# EAGLE schematic module (EAGLE 7.6.0)
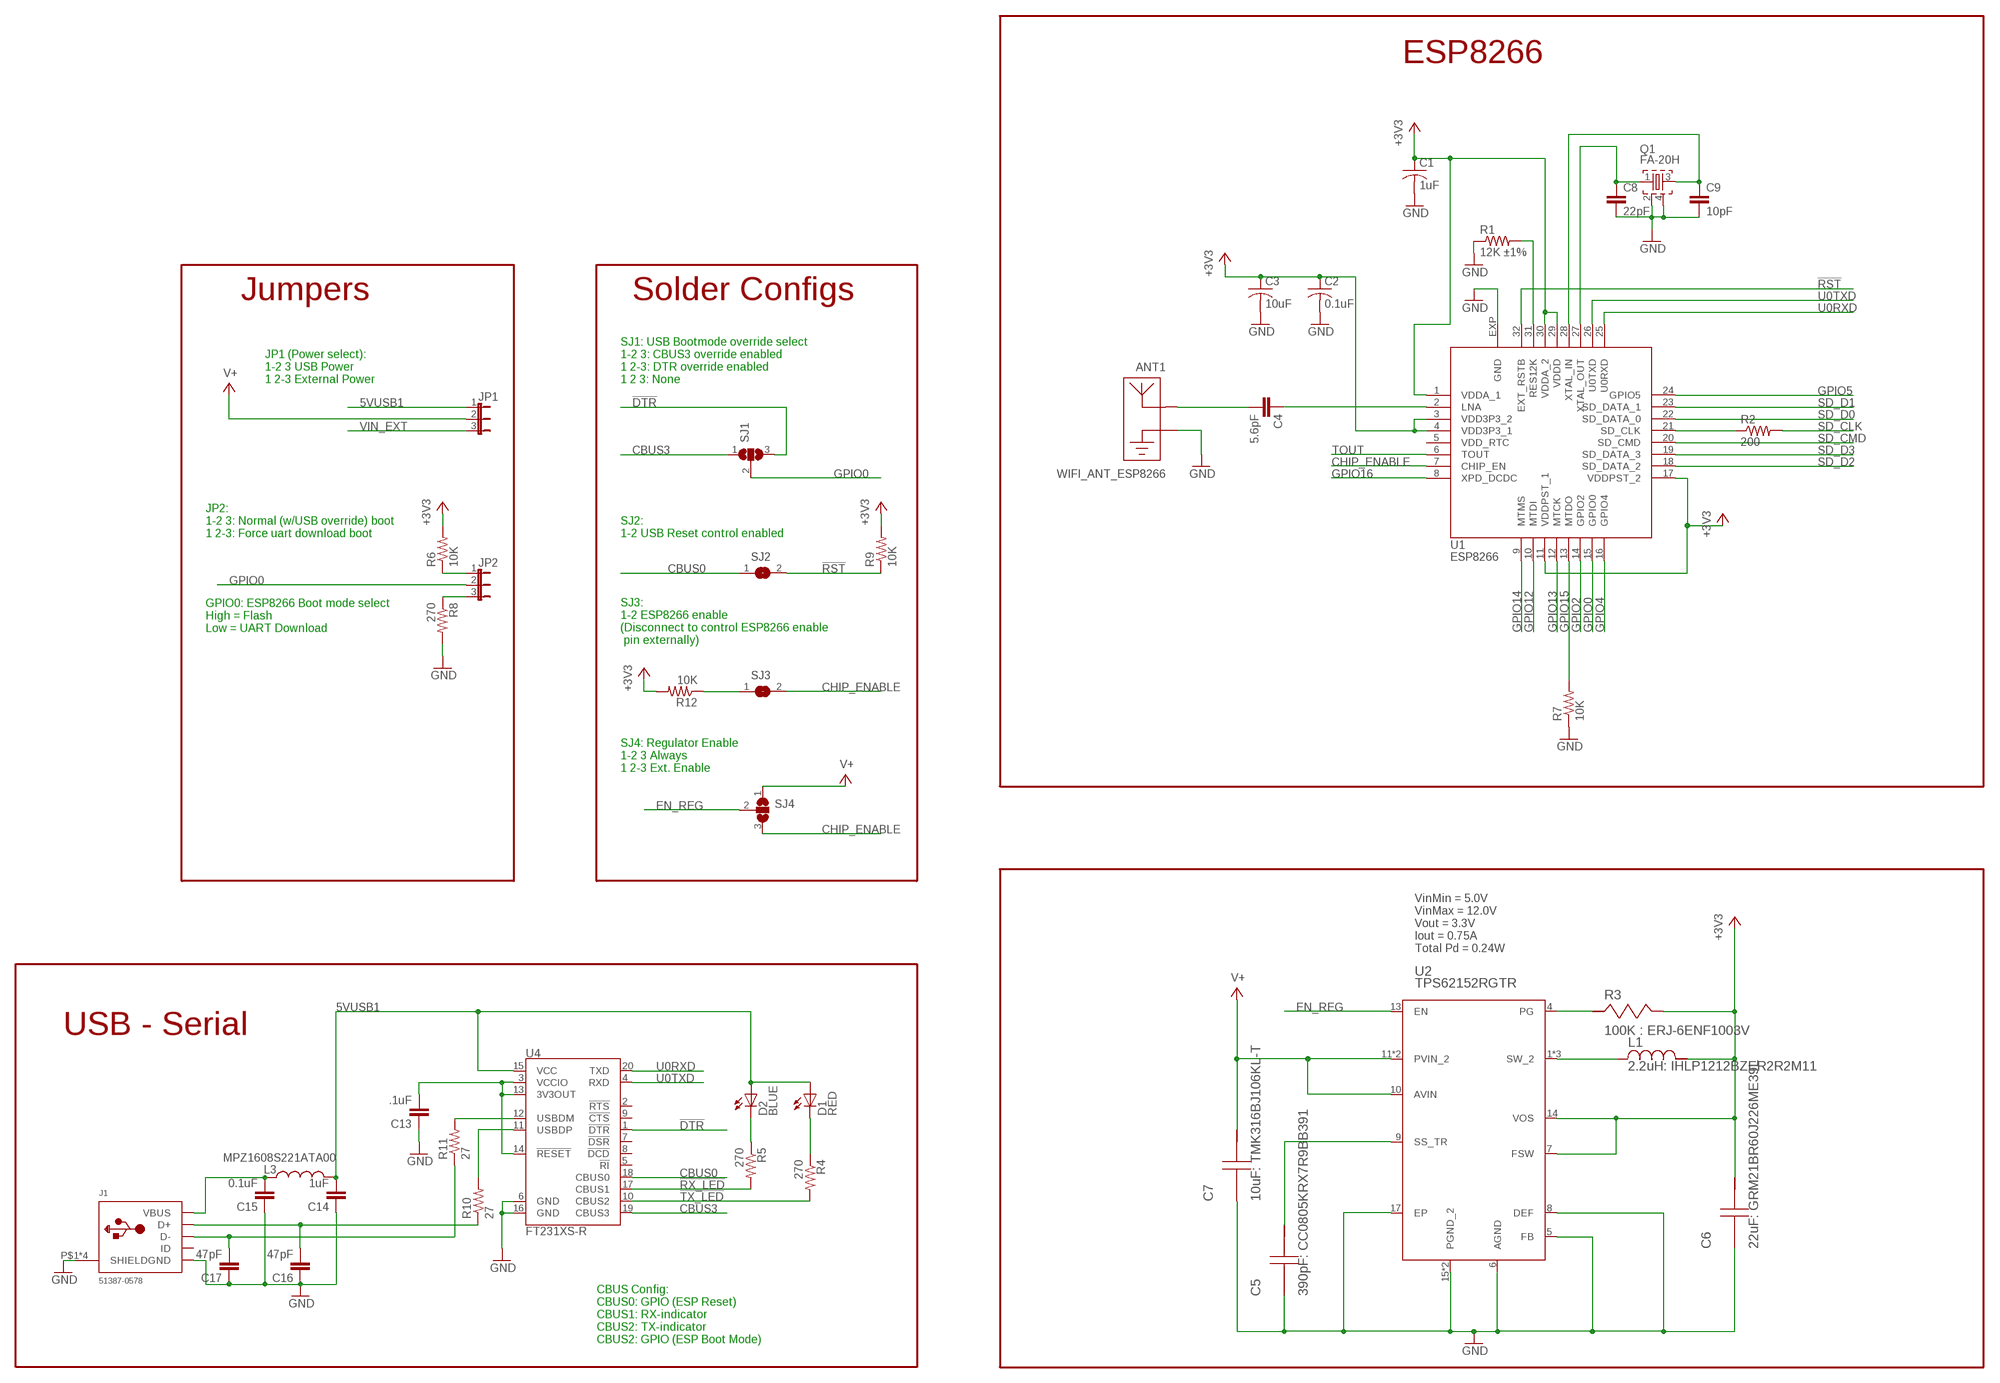
[diagram p0: schematic, sheet 1, part 1 of 2]
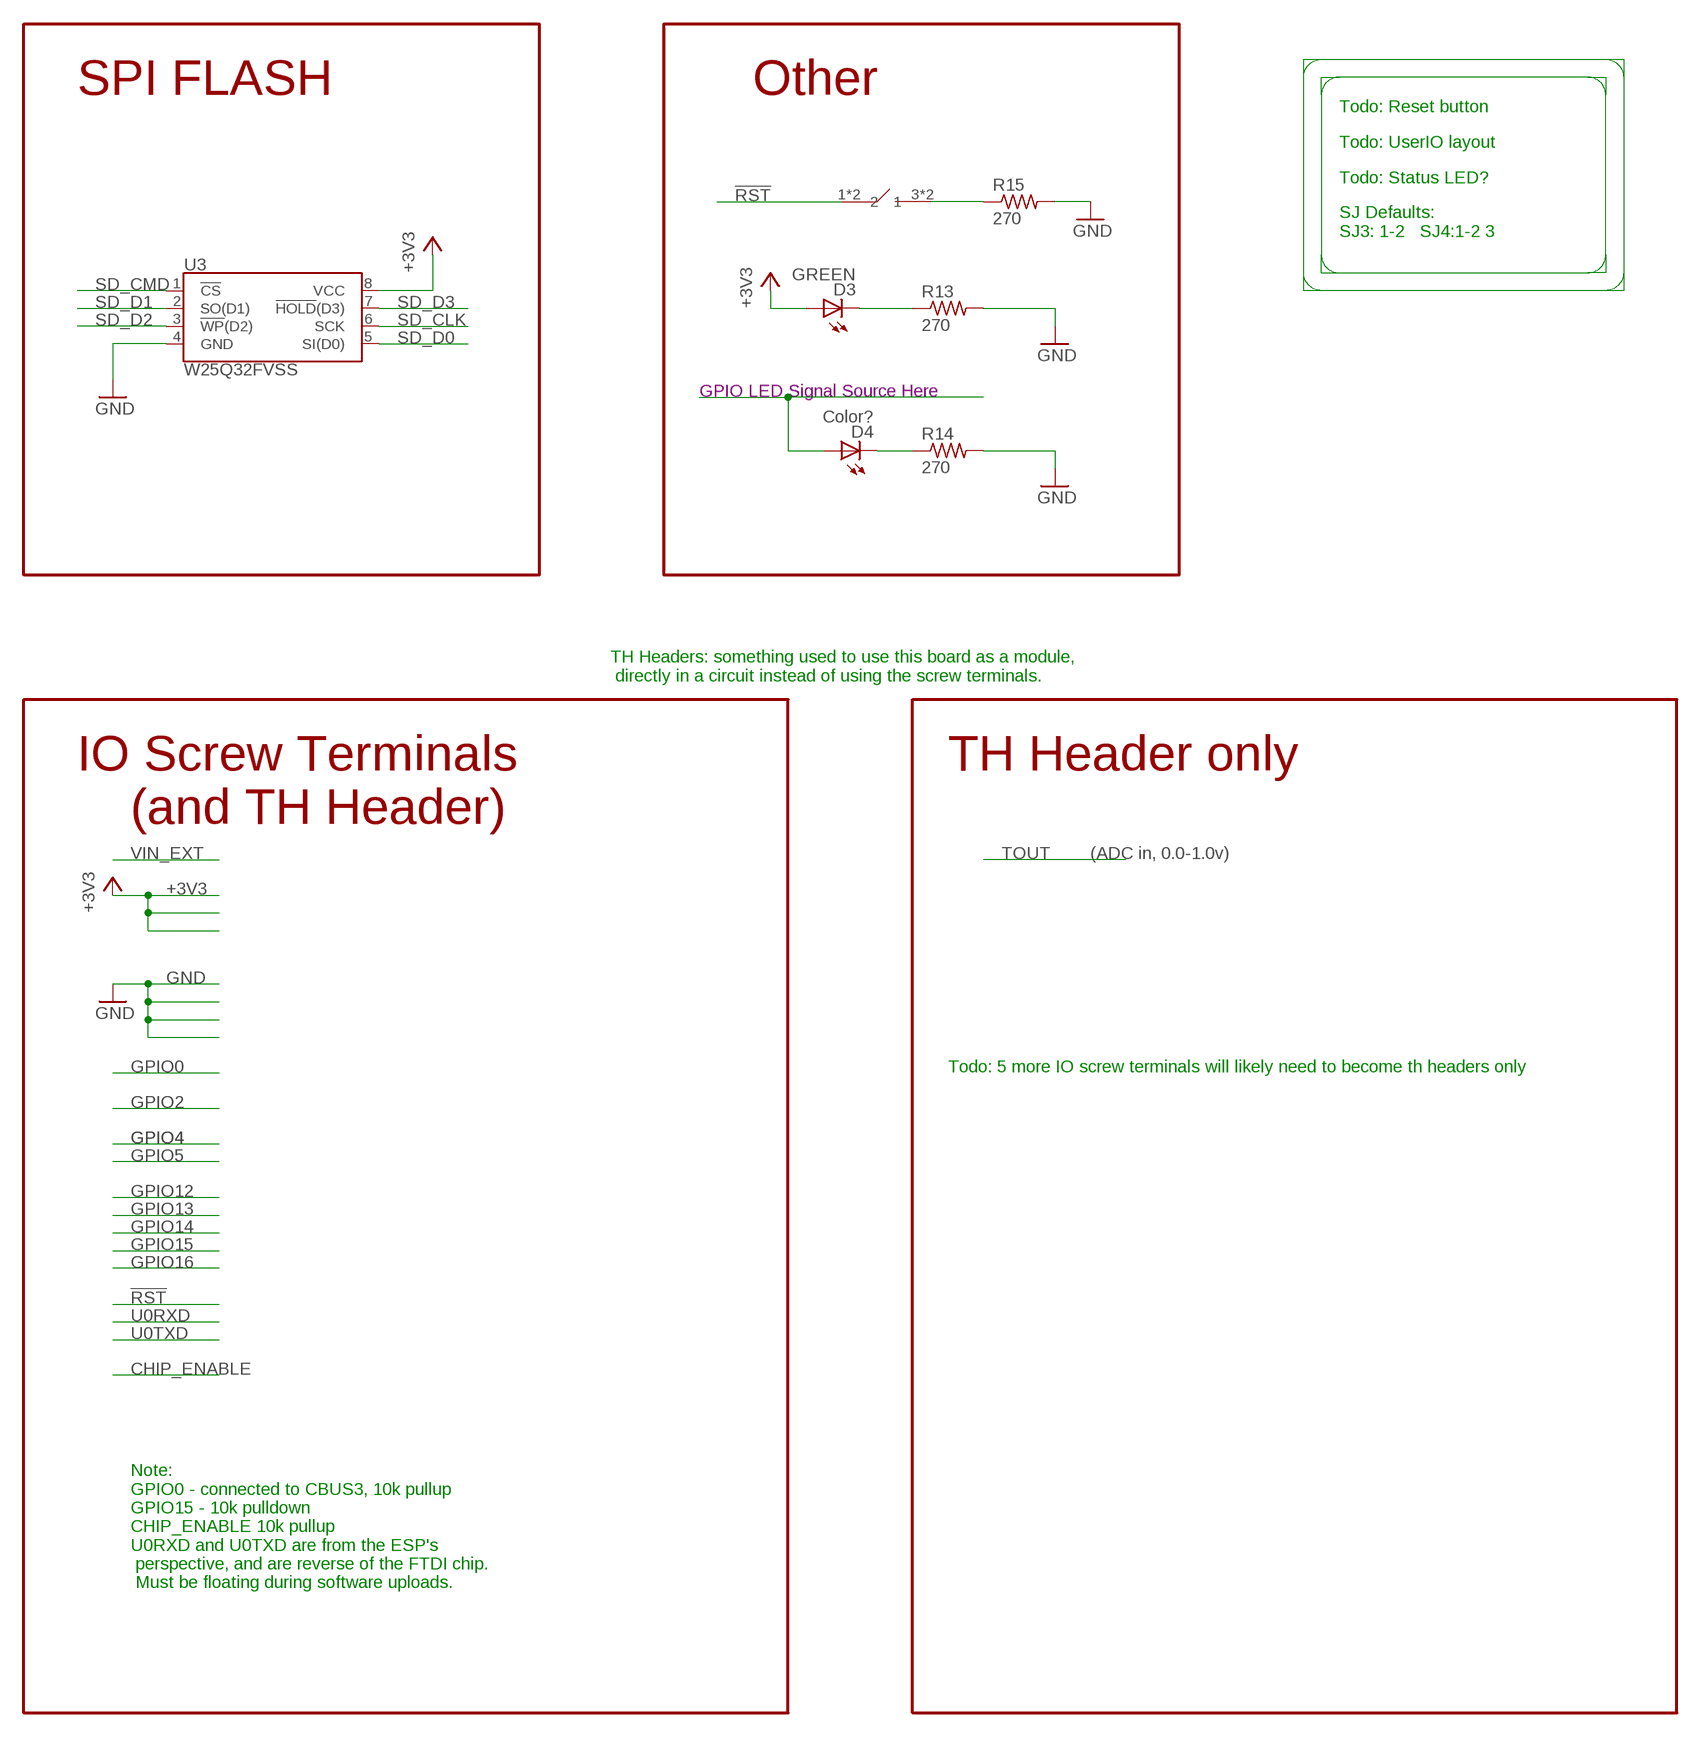
[diagram p1: schematic, sheet 1, part 2 of 2]

## Parts
ANT1  WIFI_ANT_ESP8266  [ESP8266_ANT]
C1  1uF  C-USC0603  [C0603]
C2  0.1uF  C-USC0603  [C0603]
C3  10uF  C-USC0805  [C0805]
C4  5.6pF  C-EUC0603  [C0603]
C5  390pF: CC0805KRX7R9BB391  CC0805KRX7R9BB391  [0805]
C6  22uF: GRM21BR60J226ME39L  GRM21BR60J226ME39L  [0805]
C7  10uF: TMK316BJ106KL-T  TMK316BJ106KL-T  [1206]
C8  22pF  C-EUC0603  [C0603]
C9  10pF  C-EUC0603  [C0603]
C13  .1uF  C-EUC0603K  [C0603K]
C14  1uF  C-EUC0603K  [C0603K]
C15  0.1uF  C-EUC0603K  [C0603K]
C16  47pF  C-EUC0603K  [C0603K]
C17  47pF  C-EUC0603K  [C0603K]
D1  RED  LEDCHIPLED_0603  [CHIPLED_0603]
D2  BLUE  LEDCHIPLED_0603  [CHIPLED_0603]
D3  GREEN  LEDCHIPLED_0603  [CHIPLED_0603]
D4  Color?  LEDCHIPLED_0603  [CHIPLED_0603]
J1  51387-0578  USB  [USB-MINIB-0513870578]
JP1  JP2E  [JP2]
JP2  JP2E  [JP2]
L1  2.2uH: IHLP1212BZER2R2M11  IHLP1212BZER2R2M11  [IHLP-1212BZ]
L3  MPZ1608S221ATA00  INDUCTOR0603  [0603]
Q1  FA-20H  [FA-20H]
R1  12K ±1%  R-US_R0603  [R0603]
R2  200  R-US_R0603  [R0603]
R3  100K : ERJ-6ENF1003V  ERJ-6ENF1003V  [0805]
R4  270  R-US_R0603  [R0603]
R5  270  R-US_R0603  [R0603]
R6  10K  R-US_R0603  [R0603]
R7  10K  R-US_R0603  [R0603]
R8  270  R-US_R0603  [R0603]
R9  10K  R-US_R0603  [R0603]
R10  27  R-US_R0603  [R0603]
R11  27  R-US_R0603  [R0603]
R12  10K  R-US_R0603  [R0603]
R13  270  R-US_R0603  [R0603]
R14  270  R-US_R0603  [R0603]
R15  270  R-US_R0603  [R0603]
SJ1  SJ2W  [SJ_2]
SJ2  SJ  [SJ]
SJ3  SJ  [SJ]
SJ4  SJ2W  [SJ_2]
U1  ESP8266  [HVQFN32]
U2  TPS62152RGTR  [S-PVQFN-N16]
U3  W25Q32FVSS  [SOIC-8]
U4  FT231XS-R  FT231XS  [SSOP20_L]
U$1  PTS645SM43SMTR92DEFAULT  [PTS645SM43SMTR92]

## Nets
5VUSB1: C14.2 D1.A D2.A JP1.1 L3.2 U4.15(VCC)
!DTR: SJ1.3 U4.1(!DTR)
!RST: R9.1 SJ2.2 U1.32(EXT_RSTB) U$1.1 U$1.2
!RX_LED: R5.2 U4.17(CBUS1)
!TX_LED: R4.2 U4.10(CBUS2)
+3V3: C1.1 C2.1 C3.1 C6.1 D3.A L1.2 R3.1 R6.2 R9.2 R12.2 U1.1(VDDA_1) U1.3(VDD3P3_2) U1.4(VDD3P3_1) U1.11(VDDPST_1) U1.17(VDDPST_2) U1.29(VDDD) U1.30(VDDA_2) U2.7(FSW) U2.14(VOS) U3.8(VCC)
CBUS0: SJ2.1 U4.18(CBUS0)
CBUS3: SJ1.1 U4.19(CBUS3)
CHIP_ENABLE: SJ3.2 SJ4.3 U1.7(CHIP_EN)
EN_REG: SJ4.2 U2.13(EN)
GND: ANT1.GND C1.2 C2.2 C3.2 C5.2 C6.2 C7.2 C8.2 C9.2 C13.1 C14.1 C15.1 C16.1 C17.1 J1.GND J1.P$1(SHIELD) J1.P$2(SHIELD) J1.P$3(SHIELD) J1.P$4(SHIELD) Q1.2 Q1.4 R1.1 R7.1 R8.2 R13.2 R14.2 R15.2 U1.EXP(GND) U2.5(FB) U2.6(AGND) U2.8(DEF) U2.15(PGND_2) U2.16(PGND_2) U2.17(EP) U3.4(GND) U4.6(GND) U4.16(GND)
GPIO0: JP2.2 SJ1.2 U1.15(GPIO0)
GPIO2: U1.14(GPIO2)
GPIO4: U1.16(GPIO4)
GPIO5: U1.24(GPIO5)
GPIO12: U1.10(MTDI)
GPIO13: U1.12(MTCK)
GPIO14: U1.9(MTMS)
GPIO15: R7.2 U1.13(MTDO)
GPIO16: U1.8(XPD_DCDC)
N$1: R1.2 U1.31(RES12K)
N$2: R2.1 U1.21(SD_CLK)
N$3: C4.1 U1.2(LNA)
N$4: ANT1.ANT C4.2
N$5: JP2.3 R8.1
N$7: C5.1 U2.9(SS_TR)
N$9: JP2.1 R6.1
N$10: R3.2 U2.4(PG)
N$11: L1.1 U2.1(SW_2) U2.2(SW_2) U2.3(SW_2)
N$12: C17.2 J1.D- R11.1
N$13: C16.2 J1.D+ R10.1
N$14: C13.2 U4.3(VCCIO) U4.13(3V3OUT) U4.14(!RESET)
N$15: D1.C R4.1
N$16: D2.C R5.1
N$17: R11.2 U4.12(USBDM)
N$18: R12.1 SJ3.1
N$19: R10.2 U4.11(USBDP)
N$20: C15.2 J1.VBUS L3.1
N$21: D3.C R13.1
N$22: C9.1 Q1.3 U1.28(XTAL_IN)
N$23: C8.1 Q1.1 U1.27(XTAL_OUT)
N$24: D4.A
N$25: D4.C R14.1
N$26: R15.1 U$1.3 U$1.4
SD_CLK: R2.2 U3.6(SCK)
SD_CMD: U1.20(SD_CMD) U3.1(!CS!)
SD_D0: U1.22(SD_DATA_0) U3.5(SI(D0))
SD_D1: U1.23(SD_DATA_1) U3.2(SO(D1))
SD_D2: U1.18(SD_DATA_2) U3.3(!WP!(D2))
SD_D3: U1.19(SD_DATA_3) U3.7(!HOLD!(D3))
TOUT: U1.6(TOUT)
U0RXD: U1.25(U0RXD) U4.20(TXD)
U0TXD: U1.26(U0TXD) U4.4(RXD)
V+: C7.1 JP1.2 SJ4.1 U2.10(AVIN) U2.11(PVIN_2) U2.12(PVIN_2)
VIN_EXT: JP1.3
Unconnected: J1.ID U1.5(VDD_RTC) U4.2(!RTS) U4.5(!RI) U4.7(!DSR) U4.8(!DCD) U4.9(!CTS)

## Notes on the sheet
- ESP8266
- SPI FLASH | Other
- Jumpers | Solder Configs | Todo: Reset button
- Todo: UserIO layout
- Todo: Status LED?
- JP1 (Power select):
  1-2 3 USB Power
  1 2-3 External Power
- SJ1: USB Bootmode override select
  1-2 3: CBUS3 override enabled
  1 2-3: DTR override enabled
  1 2 3: None
- SJ Defaults:
  SJ3: 1-2   SJ4:1-2 3
- GPIO LED Signal Source Here
- JP2:
  1-2 3: Normal (w/USB override) boot
  1 2-3: Force uart download boot
- SJ2:
  1-2 USB Reset control enabled
- Todo: External Power
- GPIO0: ESP8266 Boot mode select
  High = Flash
  Low = UART Download
- SJ3:
  1-2 ESP8266 enable 
  (Disconnect to control ESP8266 enable 
   pin externally)
- TH Headers: something used to use this board as a module,
   directly in a circuit instead of using the screw terminals.
- SJ4: Regulator Enable
  1-2 3 Always
  1 2-3 Ext. Enable
- IO Screw Terminals | TH Header only
- (and TH Header)
- (ADC in, 0.0-1.0v)
- Todo: 5 more IO screw terminals will likely need to become th headers only
- VinMin = 5.0V
  VinMax = 12.0V
  Vout = 3.3V
  Iout = 0.75A
  Total Pd = 0.24W
- USB - Serial
- Note:
  GPIO0 - connected to CBUS3, 10k pullup
  GPIO15 - 10k pulldown
  CHIP_ENABLE 10k pullup
  U0RXD and U0TXD are from the ESP's
   perspective, and are reverse of the FTDI chip.
   Must be floating during software uploads.
- CBUS Config:
  CBUS0: GPIO (ESP Reset)
  CBUS1: RX-indicator
  CBUS2: TX-indicator
  CBUS2: GPIO (ESP Boot Mode)

## Library data of the parts
ANT1 = OLIMEX_ANT:WIFI_ANT_ESP8266
C1-C3 = rcl:C-US: CAPACITOR, American symbol
C4 C8 C9 = rcl:C-EU: CAPACITOR, European symbol
C5 = power:CC0805KRX7R9BB391; CAP: 3.9E-10; ESR: 0.0; IRMS: 0.0; MANUFACTURER_NAME: Yageo America; MANUFACTURER_PART_NUMBER: CC0805KRX7R9BB391; VDC: 50.0; VENDOR: Yageo America
C6 = power:GRM21BR60J226ME39L; CAP: 2.2E-5; ESR: 0.0; IRMS: 0.0; MANUFACTURER_NAME: MuRata; MANUFACTURER_PART_NUMBER: GRM21BR60J226ME39L; VDC: 6.3; VENDOR: MuRata
C7 = power:TMK316BJ106KL-T; CAP: 1.0E-5; ESR: 0.0; IRMS: 0.0; MANUFACTURER_NAME: Taiyo Yuden; MANUFACTURER_PART_NUMBER: TMK316BJ106KL-T; VDC: 25.0; VENDOR: Taiyo Yuden
C13-C17 = resistor:C-EU: CAPACITOR, European symbol
D1-D4 = led:LED: LED OSRAM: - CHIPLED LG R971, LG N971, LY N971, LG Q971, LY Q971, LO R971, LY R971 LH N974, LH R974 LS Q976, LO Q976, LY Q976 LO Q996 - Hyper CHIPLED LW Q18S LB Q993, LB Q99A, LB R99A - SideLED LS A670, LO A670, LY A670, LG A670, LP A670 LB A673, LV A673, LT A673, LW A673 LH A674 LY A675 LS A676, LA A676, LO A676, LY A676, LW A676 LS A679, LY A679, LG A679 - Hyper Micro SIDELED® LS Y876, LA Y876, LO Y876, LY Y876 LT Y87S - SmartLED LW L88C, LW L88S LB L89C, LB L89S, LG L890 LS L89K, LO L89K, LY L89K LS L896, LA L896, LO L896, LY L896 - TOPLED LS T670, LO T670, LY T670, LG T670, LP T670 LSG T670, LSP T670, LSY T670, LOP T670, LYG T670 LG T671, LOG T671, LSG T671 LB T673, LV T673, LT T673, LW T673 LH T674 LS T676, LA T676, LO T676, LY T676, LB T676, LH T676, LSB T676, LW T676 LB T67C, LV T67C, LT T67C, LS T67K, LO T67K, LY T67K, LW E67C LS E67B, LA E67B, LO E67B, LY E67B, LB E67C, LV E67C, LT E67C LW T67C LS T679, LY T679, LG T679 LS T770, LO T770, LY T770, LG T770, LP T770 LB T773, LV T773, LT T773, LW T773 LH T774 LS E675, LA E675, LY E675, LS T675 LS T776, LA T776, LO T776, LY T776, LB T776 LHGB T686 LT T68C, LB T68C - Hyper Mini TOPLED® LB M676 - Mini TOPLED Santana® LG M470 LS M47K, LO M47K, LY M47K Source: http://www.osram.convergy.de LUXEON: - LUMILED® LXK2-PW12-R00, LXK2-PW12-S00, LXK2-PW14-U00, LXK2-PW14-V00 LXK2-PM12-R00, LXK2-PM12-S00, LXK2-PM14-U00 LXK2-PE12-Q00, LXK2-PE12-R00, LXK2-PE12-S00, LXK2-PE14-T00, LXK2-PE14-U00 LXK2-PB12-K00, LXK2-PB12-L00, LXK2-PB12-M00, LXK2-PB14-N00, LXK2-PB14-P00, LXK2-PB14-Q00 LXK2-PR12-L00, LXK2-PR12-M00, LXK2-PR14-Q00, LXK2-PR14-R00 LXK2-PD12-Q00, LXK2-PD12-R00, LXK2-PD12-S00 LXK2-PH12-R00, LXK2-PH12-S00 LXK2-PL12-P00, LXK2-PL12-Q00, LXK2-PL12-R00 Source: www.luxeon.com KINGBRIGHT: KA-3528ASYC Source: www.kingbright.com
J1 = adafruit:USB: USB Connectors USBMINIB - Surface Mount Female Mini-B USB Connector 4UConnector: 06564 By microbuilder.eu Thru-hole RA Female Mini-B USB Connector 4UConnector: 18732 By ladyada.net
JP1 JP2 = jumper:JP2E: JUMPER
L1 = power:IHLP1212BZER2R2M11; DATASHEETURL: http://www.vishay.com/docs/34289/lp12bz11.pdf; DCR: 46.0; DESCRIPTION: Unknown; IDC: 3.0; L: 2.2E-6; MANUFACTURER: Vishay; MANUFACTURER_NAME: Vishay-Dale; MANUFACTURER_PART_NUMBER: IHLP1212BZER2R2M11; PACKAGE_DESIGNATOR: IHLP-1212BZ; VENDOR: Vishay-Dale
L3 = SparkFun-Passives:INDUCTOR: Inductors Basic Inductor/Choke - 0603 and 1206. Footprints are not proven and vary greatly between part numbers. INDUCTOR POWER 3.3UH 4.0A SMD 0.197" L x 0.197" W x 0.177" H (5.00mm x 5.00mm x 4.50mm)
Q1 = crystal:FA-: MHz RANGE CRYSTAL UNIT Source: Epson Toyocom
R1 R2 R6 R7 R9 R12 = rcl:R-US_: RESISTOR, American symbol
R3 = power:ERJ-6ENF1003V; MANUFACTURER_NAME: Panasonic; MANUFACTURER_PART_NUMBER: ERJ-6ENF1003V; POWER: 0.125; RESISTANCE: 100000.0; TOLERANCE: 1.0; VENDOR: Panasonic
R4 R5 R8 R10 R11 R13-R15 = resistor:R-US_: RESISTOR, American symbol
SJ1 SJ4 = jumper:SJ2W: SMD solder JUMPER
SJ2 SJ3 = jumper:SJ: SMD solder JUMPER
U1 = esp8266:ESP8266
U2 = power:TPS62152RGTR; DATASHEETURL: http://www.ti.com/product/tps62131; FREQUENCY: 2500000.0; IMAX: 3.0; MANUFACTURER_NAME: Texas Instruments; MANUFACTURER_PART_NUMBER: TPS62131RGTR; MKTG_PACKAGE: S-PVQFN-N16; NSID: TPS62131RGTR; PACKAGE: S-PVQFN-N16; VENDOR: Texas Instruments
U3 = SparkFun-DigitalIC:W25Q32FV: Winbond W25Q32FV 32Mbit (4MB) Flash The W25Q32FV support the standard Serial Peripheral Interface (SPI), Dual/Quad I/O SPI as well as 2-clocks instruction cycle Quad Peripheral Interface (QPI). Datasheet <http://www.winbond.com/resource-files/w25q32fv%20revh%20091613.pdf>; PROD_ID: IC-13229
U4 = SparkFun-DigitalIC:FT231X: FTDI FT231X Full Speed USB to Full-handshake UART This USB2.0 Full Speed IC offers a compact bridge to full handshake UART interfaces. The device is a UART, capable of operating up to 3MBaud, with low power consumption (8mA). The FT231X includes the complete FT-X series feature set and enables USB to be added into a system design quickly and easily over a UART interface.; PROD_ID: IC-11524; VALUE: FTS31XS-U
U$1 = button:PTS645SM43SMTR92